# EAGLE schematic feeder-meteo-clock (EAGLE 6.1)
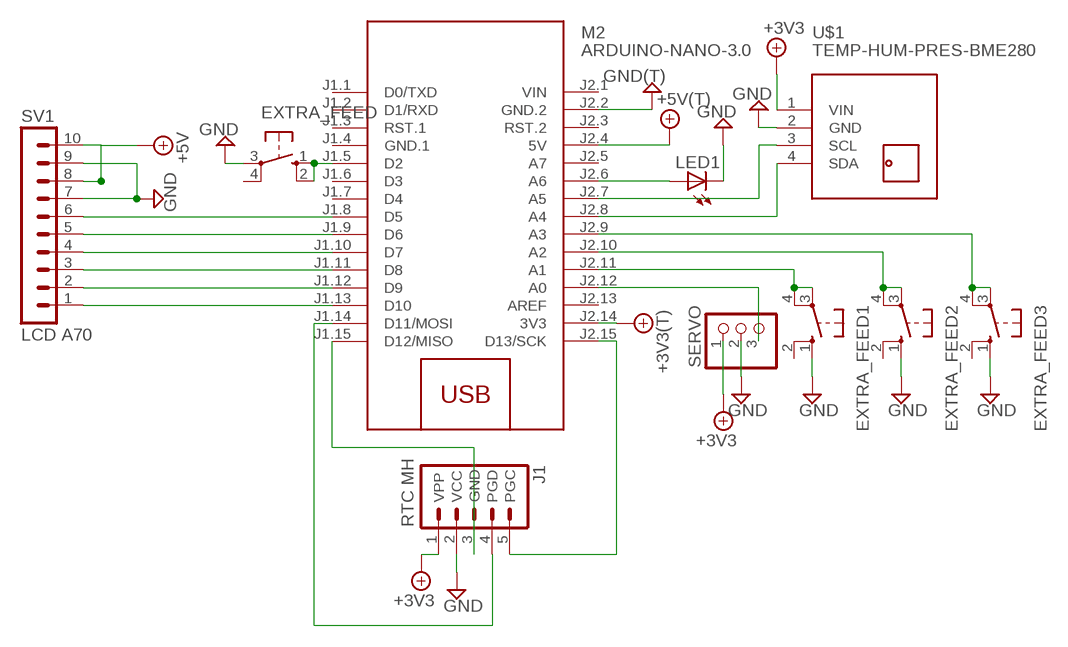
[diagram p0: schematic, sheet 1]

## Parts
+3V1  +3V3(T)  +18V(T)  [SQUARE]
+9V1  +5V(T)  +9V(T)  [SQUARE]
EXTRA_FEED  10-XX  [B3F-10XX]
EXTRA_FEED1  10-XX  [B3F-10XX]
EXTRA_FEED2  10-XX  [B3F-10XX]
EXTRA_FEED3  10-XX  [B3F-10XX]
GND1  GND(T)  [SQUARE]
J1  RTC MH  PIC_ICSP_MINI_5_PIN  [PIC_ICSP_MINI_5_PIN]
LED1  LED3MM  [LED3MM]
M2  ARDUINO-NANO-3.0  [ARDUINO-NANO-3.0]
SERVO  PINHD-1X3  [1X03]
SV1  LCD A70  MA10-1  [MA10-1]
U$1  TEMP-HUM-PRES-BME280  [TEMP-HUM-PRES-BME280]

## Nets
+9V: +9V1.1(+9V) M2.J2.4(5V) SV1.8 SV1.10 ; supply symbol labelled +5V
+18V: +3V1.1(+18V) J1.1(VPP) M2.J2.14(3V3) SERVO.1 U$1.1(VIN) ; supply symbol labelled +3V3
GND: EXTRA_FEED1.1(S) EXTRA_FEED2.1(S) EXTRA_FEED3.1(S) EXTRA_FEED.3(P) GND1.1(GND) J1.2(VCC) LED1.K(C) M2.J2.2(GND.2) SERVO.2 SV1.7 SV1.9 U$1.2(GND)
N$1: M2.J2.8(A4) U$1.4(SDA)
N$2: M2.J2.7(A5) U$1.3(SCL)
N$3: EXTRA_FEED1.3(P) EXTRA_FEED1.4(P1) M2.J2.11(A1)
N$4: J1.5(PGC) M2.J2.15(D13/SCK)
N$5: EXTRA_FEED2.3(P) EXTRA_FEED2.4(P1) M2.J2.10(A2)
N$6: EXTRA_FEED3.3(P) EXTRA_FEED3.4(P1) M2.J2.9(A3)
N$13: J1.4(PGD) M2.J1.14(D11/MOSI)
N$14: M2.J1.8(D5) SV1.6
N$15: M2.J1.9(D6) SV1.5
N$16: J1.3(GND) M2.J1.15(D12/MISO)
N$17: LED1.A M2.J2.6(A6)
N$19: M2.J2.12(A0) SERVO.3
N$20: EXTRA_FEED.1(S) EXTRA_FEED.2(S1) M2.J1.5(D2)
N$21: M2.J1.10(D7) SV1.4
N$22: M2.J1.11(D8) SV1.3
N$23: M2.J1.12(D9) SV1.2
N$24: M2.J1.13(D10) SV1.1
Unconnected: EXTRA_FEED1.2(S1) EXTRA_FEED2.2(S1) EXTRA_FEED3.2(S1) EXTRA_FEED.4(P1) M2.J1.1(D0/TXD) M2.J1.2(D1/RXD) M2.J1.3(RST.1) M2.J1.6(D3) M2.J1.7(D4) M2.J2.3(RST.2) M2.J2.5(A7) M2.J2.13(AREF)

## Power pins joined to a net without a drawn wire
GND.1: M2.J1.4(GND.1)
VIN: M2.J2.1(VIN)

## Library data of the parts
+3V1 = gm-supply:+18V(T): +18V Voltage Supply use this to hook up +18V throughout a schematic instead of running wire automatically labels the net "+18V" adds a hookup pad to the circuit board
+9V1 = gm-supply:+9V(T): +9V Voltage Supply use this to hook up +9v throughout a schematic instead of running wire automatically labels the net "+9v" adds a hookup pad to the circuit board
EXTRA_FEED EXTRA_FEED1-EXTRA_FEED3 = switch-omron:10-XX: OMRON SWITCH; MPN: B3F-1000; OC_FARNELL: 176432; OC_NEWARK: 36M3542
GND1 = gm-supply:GND(T): Ground use this to hook up ground (GND) throughout a schematic instead of running wire automatically labels the net "GND" adds a hookup pad to the circuit board (you can use several)
J1 = SparkFun-Connectors:PIC_ICSP_MINI_5_PIN: PIC-ICSP-Mini Miniature 5-pin connection for temporary programming of PICs. Use this device in your design to save space. Miniature ISCP Programming connector for PICs This 5 pin header contains all the lines necessary for programming most PIC microcontrollers. Use this device in your design to save space. Here is the connector we sell at SparkFun: 5-Pin Mini ICSP Connector <https://www.sparkfun.com/products/11264> (PRT-11264) It is used on these SparkFun products: USB Bit Whacker - 18F2553 Development Board <https://www.sparkfun.com/products/762> (DEV-00762) SparkFun Serial Enabled LCD Backpack <https://www.sparkfun.com/products/258> (LCD-00258) Also, if you need a nice PIC programmer, please check these out: MPLAB PICkit 3 <https://www.sparkfun.com/products/9973> (PGM-09973); PROD_ID: CONN-08314; SF_ID: PRT-11264
LED1 = led:LED: LED OSRAM: - CHIPLED LG R971, LG N971, LY N971, LG Q971, LY Q971, LO R971, LY R971 LH N974, LH R974 LS Q976, LO Q976, LY Q976 LO Q996 - Hyper CHIPLED LW Q18S LB Q993, LB Q99A, LB R99A - SideLED LS A670, LO A670, LY A670, LG A670, LP A670 LB A673, LV A673, LT A673, LW A673 LH A674 LY A675 LS A676, LA A676, LO A676, LY A676, LW A676 LS A679, LY A679, LG A679 - Hyper Micro SIDELED® LS Y876, LA Y876, LO Y876, LY Y876 LT Y87S - SmartLED LW L88C, LW L88S LB L89C, LB L89S, LG L890 LS L89K, LO L89K, LY L89K LS L896, LA L896, LO L896, LY L896 - TOPLED LS T670, LO T670, LY T670, LG T670, LP T670 LSG T670, LSP T670, LSY T670, LOP T670, LYG T670 LG T671, LOG T671, LSG T671 LB T673, LV T673, LT T673, LW T673 LH T674 LS T676, LA T676, LO T676, LY T676, LB T676, LH T676, LSB T676, LW T676 LB T67C, LV T67C, LT T67C, LS T67K, LO T67K, LY T67K, LW E67C LS E67B, LA E67B, LO E67B, LY E67B, LB E67C, LV E67C, LT E67C LW T67C LS T679, LY T679, LG T679 LS T770, LO T770, LY T770, LG T770, LP T770 LB T773, LV T773, LT T773, LW T773 LH T774 LS E675, LA E675, LY E675, LS T675 LS T776, LA T776, LO T776, LY T776, LB T776 LHGB T686 LT T68C, LB T68C - Hyper Mini TOPLED® LB M676 - Mini TOPLED Santana® LG M470 LS M47K, LO M47K, LY M47K Source: http://www.osram.convergy.de LUXEON: - LUMILED® LXK2-PW12-R00, LXK2-PW12-S00, LXK2-PW14-U00, LXK2-PW14-V00 LXK2-PM12-R00, LXK2-PM12-S00, LXK2-PM14-U00 LXK2-PE12-Q00, LXK2-PE12-R00, LXK2-PE12-S00, LXK2-PE14-T00, LXK2-PE14-U00 LXK2-PB12-K00, LXK2-PB12-L00, LXK2-PB12-M00, LXK2-PB14-N00, LXK2-PB14-P00, LXK2-PB14-Q00 LXK2-PR12-L00, LXK2-PR12-M00, LXK2-PR14-Q00, LXK2-PR14-R00 LXK2-PD12-Q00, LXK2-PD12-R00, LXK2-PD12-S00 LXK2-PH12-R00, LXK2-PH12-S00 LXK2-PL12-P00, LXK2-PL12-Q00, LXK2-PL12-R00 Source: www.luxeon.com KINGBRIGHT: KA-3528ASYC Source: www.kingbright.com
M2 = diy-modules:ARDUINO-NANO-3.0: Arduino Nano 3.0
SERVO = pinhead:PINHD-1X3: PIN HEADER
SV1 = con-lstb:MA10-1: PIN HEADER; OC_FARNELL: unknown; OC_NEWARK: unknown
U$1 = diy-modules:TEMP-HUM-PRES-BME280: Digital Humidity-Temperature-Pressure Sensor based on BME280 device More information about BME280 device is available here: https://www.bosch-sensortec.com/bst/products/all_products/bme280 Click here to find device on ebay.com <http://www.ebay.com/sch/bme280+breakout>